# Altium schematic sheet Comparator.SchDoc
size A4
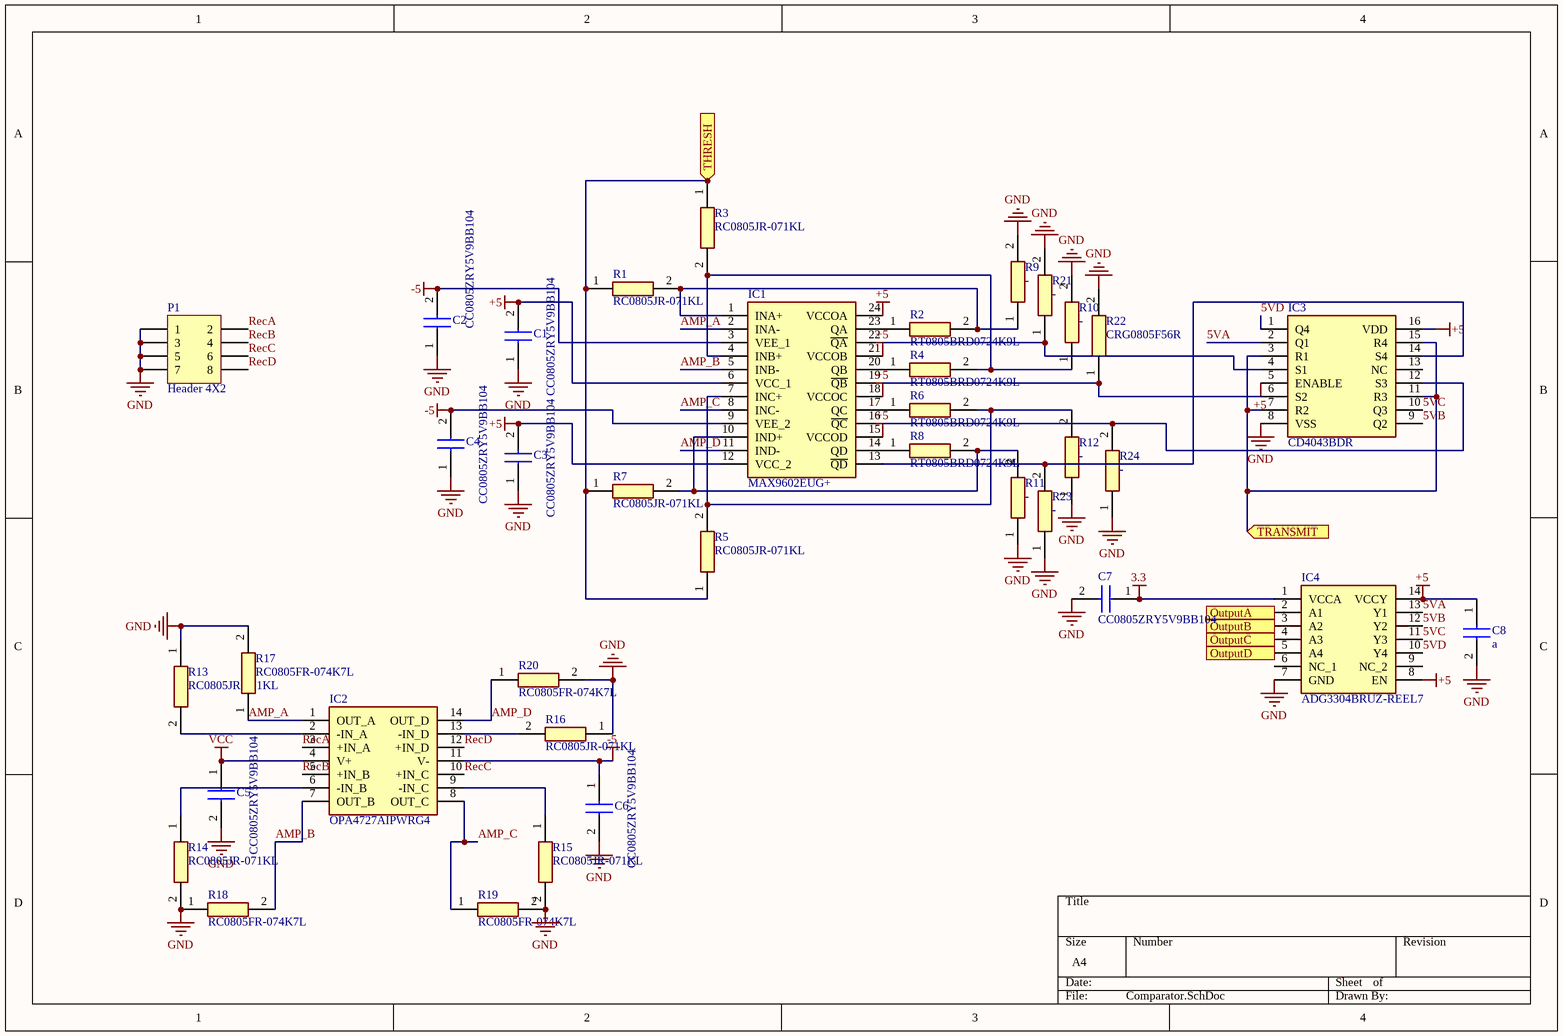
[diagram p0: Comparator.SchDoc]

## Parts
C1  CC0805ZRY5V9BB104  [CAPC2013X70N]
C2  CC0805ZRY5V9BB104  [CAPC2013X70N]
C3  CC0805ZRY5V9BB104  [CAPC2013X70N]
C4  CC0805ZRY5V9BB104  [CAPC2013X70N]
C5  CC0805ZRY5V9BB104  [CAPC2013X70N]
C6  CC0805ZRY5V9BB104  [CAPC2013X70N]
C7  CC0805ZRY5V9BB104  [CAPC2013X70N]
C8  a  [CAPC2013X70N]
IC1  MAX9602EUG+  [SOP65P640X110-24N]
IC2  OPA4727AIPWRG4  [SOP65P640X120-14N]
IC3  CD4043BDR  [SOIC127P600X175-16N]
IC4  ADG3304BRUZ-REEL7  [SOP65P640X120-14N]
P1  Header 4X2  [HDR2X4]
R1  RC0805JR-071KL  [RESC2012X60N]
R2  RT0805BRD0724K9L  [RESC2012X60N]
R3  RC0805JR-071KL  [RESC2012X60N]
R4  RT0805BRD0724K9L  [RESC2012X60N]
R5  RC0805JR-071KL  [RESC2012X60N]
R6  RT0805BRD0724K9L  [RESC2012X60N]
R7  RC0805JR-071KL  [RESC2012X60N]
R8  RT0805BRD0724K9L  [RESC2012X60N]
R9  -  [RESC2012X65N]
R10  -  [RESC2012X65N]
R11  -  [RESC2012X65N]
R12  -  [RESC2012X65N]
R13  RC0805JR-071KL  [RESC2012X60N]
R14  RC0805JR-071KL  [RESC2012X60N]
R15  RC0805JR-071KL  [RESC2012X60N]
R16  RC0805JR-071KL  [RESC2012X60N]
R17  RC0805FR-074K7L  [RESC2012X60N]
R18  RC0805FR-074K7L  [RESC2012X60N]
R19  RC0805FR-074K7L  [RESC2012X60N]
R20  RC0805FR-074K7L  [RESC2012X60N]
R21  -  [RESC2012X65N]
R22  CRG0805F56R  [RESC2012X65N]
R23  -  [RESC2012X65N]
R24  -  [RESC2012X65N]

## Ports
OutputA (out), OutputB (out), OutputC (out), OutputD (out), THRESH (in), TRANSMIT (in)

## Nets
3.3: C7.1(C1) IC4.1(VCCA)
+5: C1.2(C2) C3.2(C2) C8.1(C1) IC1.6(VCC_1) IC1.12(VCC_2) IC1.15(VCCOD) IC1.18(VCCOC) IC1.21(VCCOB) IC1.24(VCCOA) IC3.5(ENABLE) IC3.16(VDD) IC4.8(EN) IC4.14(VCCY)
-5: C2.2(C2) C4.2(C2) C6.1(C1) IC1.3(VEE_1) IC1.9(VEE_2) IC2.11(V-)
GND: C1.1(C1) C2.1(C1) C3.1(C1) C4.1(C1) C5.2(C2) C6.2(C2) C7.2(C2) C8.2(C2) IC3.8(VSS) IC4.7(GND) P1.1 P1.3 P1.5 P1.7 R9.2 R10.2 R11.1 R12.1 R13.1 R14.2 R15.2 R16.1 R17.2 R18.1 R19.2 R20.2 R21.2 R22.2 R23.1 R24.1
VCC: C5.1(C1) IC2.4(V+)
5VA: IC3.2(Q1) IC4.13(Y1)
5VB: IC3.9(Q2) IC4.12(Y2)
5VC: IC3.10(Q3) IC4.11(Y3)
5VD: IC3.1(Q4) IC4.10(Y4)
AMP_A: IC1.2(INA-) IC2.1(OUT_A) R17.1
AMP_B: IC1.5(INB-) IC2.7(OUT_B) R18.2
AMP_C: IC1.8(INC-) IC2.8(OUT_C) R19.1
AMP_D: IC1.11(IND-) IC2.14(OUT_D) R20.1
OutputA: IC4.2(A1) ; port OutputA
OutputB: IC4.3(A2) ; port OutputB
OutputC: IC4.4(A3) ; port OutputC
OutputD: IC4.5(A4) ; port OutputD
RecA: IC2.3(+IN_A) P1.2
RecB: IC2.5(+IN_B) P1.4
RecC: IC2.10(+IN_C) P1.6
RecD: IC2.12(+IN_D) P1.8
THRESH: R1.1 R3.1 R5.1 R7.1 ; port THRESH
TRANSMIT: IC3.3(R1) IC3.7(R2) IC3.11(R3) IC3.15(R4) ; port TRANSMIT
NetIC1_1: IC1.1(INA+) R1.2 R2.2 R9.1
NetIC1_4: IC1.4(INB+) R3.2 R4.2 R10.1
NetIC1_7: IC1.7(INC+) R5.2 R6.2 R12.2
NetIC1_10: IC1.10(IND+) R7.2 R8.2 R11.2
NetIC1_13: IC1.13(~{QD}) IC3.14(S4) R23.2
NetIC1_14: IC1.14(QD) R8.1
NetIC1_16: IC1.16(~{QC}) IC3.12(S3) R24.2
NetIC1_17: IC1.17(QC) R6.1
NetIC1_19: IC1.19(~{QB}) IC3.6(S2) R22.1
NetIC1_20: IC1.20(QB) R4.1
NetIC1_22: IC1.22(~{QA}) IC3.4(S1) R21.1
NetIC1_23: IC1.23(QA) R2.1
NetIC2_2: IC2.2(-IN_A) R13.2
NetIC2_6: IC2.6(-IN_B) R14.1
NetIC2_9: IC2.9(-IN_C) R15.1
NetIC2_13: IC2.13(-IN_D) R16.2

Not connected (* = marked no-connect by the designer): IC3 13(NC); IC4 6(NC_1) 9(NC_2)

## Library data of the parts
C1-C8 = CC0805ZRY5V9BB104: Capacitor; Manufacturer_Name: YAGEO (PHYCOMP); Datasheet Link: http://componentsearchengine.com/Datasheets/1/CC0805ZRY5V9BB104.pdf; Manufacturer_Part_Number: CC0805ZRY5V9BB104; Mouser Part Number: 603-CC805ZRY5V9BB104; Mouser Price/Stock: https://www.mouser.com/Search/Refine.aspx?Keyword=603-CC805ZRY5V9BB104
IC1 = MAX9602EUG+: Integrated Circuit; Manufacturer_Name: Maxim Integrated; Datasheet Link: https://componentsearchengine.com/Datasheets/1/MAX9602EUG+.pdf; Height: 1.1mm; Manufacturer_Part_Number: MAX9602EUG+; Mouser Part Number: 700-MAX9602EUG; Mouser Price/Stock: https://www.mouser.com/Search/Refine.aspx?Keyword=700-MAX9602EUG
IC2 = OPA4727AIPWRG4: Integrated Circuit; Manufacturer_Name: Texas Instruments; Datasheet Link: http://www.ti.com/lit/ds/symlink/opa727.pdf; Height: 1.2mm; Manufacturer_Part_Number: OPA4727AIPWRG4; Mouser Part Number: 595-OPA4727AIPWRG4; Mouser Price/Stock: https://www.mouser.com/Search/Refine.aspx?Keyword=595-OPA4727AIPWRG4
IC3 = CD4043BDR: Integrated Circuit; Manufacturer_Name: Texas Instruments; Datasheet Link: http://www.ti.com/lit/ds/symlink/cd4043b.pdf; Height: 1.75mm; Manufacturer_Part_Number: CD4043BDR; Mouser Part Number: 595-CD4043BDR; Mouser Price/Stock: https://www.mouser.com/Search/Refine.aspx?Keyword=595-CD4043BDR
IC4 = ADG3304BRUZ-REEL7: Integrated Circuit; Manufacturer_Name: Analog Devices; Datasheet Link: http://componentsearchengine.com/Datasheets/1/ADG3304BRUZ-REEL7.pdf; Height: 1.2mm; Manufacturer_Part_Number: ADG3304BRUZ-REEL7; Mouser Part Number: 584-ADG3304BRUZ-R7; Mouser Price/Stock: https://www.mouser.com/Search/Refine.aspx?Keyword=584-ADG3304BRUZ-R7
P1 = Header 4X2: Header, 4-Pin, Dual row; LatestRevisionDate: 17-Jul-2002; LatestRevisionNote: Re-released for DXP Platform.; Publisher: Altium Limited
R1 R3 R5 R7 R13-R16 = RC0805JR-071KL: Resistor; Manufacturer_Name: YAGEO (PHYCOMP); Datasheet Link: http://www.yageo.com/documents/recent/PYu-RC_Group_51_RoHS_L_10.pdf; Height: 0.6mm; Manufacturer_Part_Number: RC0805JR-071KL; Mouser Part Number: 603-RC0805JR-071KL; Mouser Price/Stock: https://www.mouser.com/Search/Refine.aspx?Keyword=603-RC0805JR-071KL
R2 R4 R6 R8 = RT0805BRD0724K9L: Resistor; Manufacturer_Name: YAGEO (PHYCOMP); Datasheet Link: http://www.yageo.com/documents/recent/PYu-RT_1-to-0.01_RoHS_L_9.pdf; Height: 0.6mm; Manufacturer_Part_Number: RT0805BRD0724K9L
R9-R12 R21-R24 = CRG0805F56R: Resistor; Manufacturer_Name: TE Connectivity; Allied_Number: 70063224; Datasheet Link: http://www.te.com/commerce/DocumentDelivery/DDEController?Action=showdoc&DocId=Customer+Drawing%7F1623109%7FBA%7Fpdf%7FEnglish%7FENG_CD_1623109_BA.pdf%7F1623109-1; Height: 0.65mm; Manufacturer_Part_Number: CRG0805F56R; RS Part Number: 2230269; RS Price/Stock: https://uk.rs-online.com/web/p/products/2230269; Allied Price/Stock: https://www.alliedelec.com/te-connectivity-crg0805f56r/70063224/
R17-R20 = RC0805FR-074K7L: Resistor; Manufacturer_Name: YAGEO (PHYCOMP); Datasheet Link: http://www.yageo.com/documents/recent/PYu-RC_Group_51_RoHS_L_10.pdf; Height: 0.6mm; Manufacturer_Part_Number: RC0805FR-074K7L; Mouser Part Number: 603-RC0805FR-074K7L; Mouser Price/Stock: https://www.mouser.com/Search/Refine.aspx?Keyword=603-RC0805FR-074K7L; RS Part Number: 6181408; RS Price/Stock: http://uk.rs-online.com/web/p/products/6181408